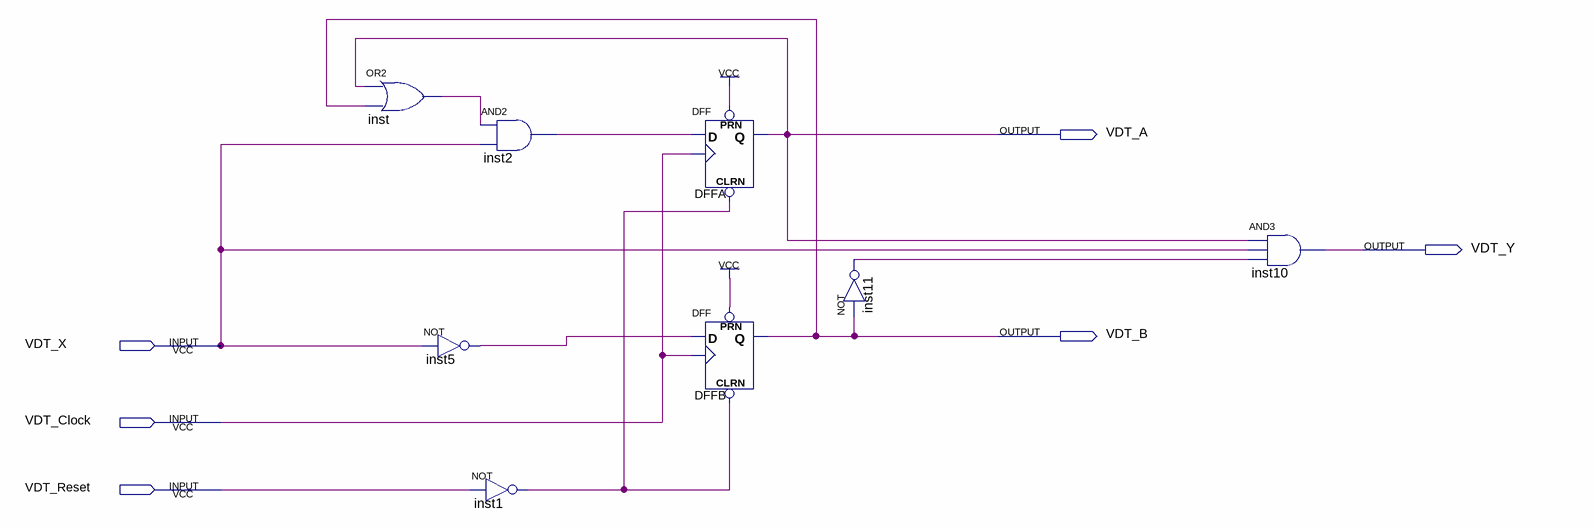
[diagram p0: schematic sheet]
// Quartus schematic assignment6.bdf as structural Verilog: 8 symbols, 6 pins
module assignment6 (
  input  VDT_X,
  input  VDT_Clock,
  input  VDT_Reset,
  output VDT_A,
  output VDT_Y,
  output VDT_B
);

  wire inst1_out, inst2_out, inst5_out, inst11_out, inst_out;

  or inst (inst_out, VDT_A, VDT_B);
  not inst5 (inst5_out, VDT_X);
  and inst2 (inst2_out, inst_out, VDT_X);
  not inst1 (inst1_out, VDT_Reset);
  DFF DFFA (.CLRN(inst1_out), .CLK(VDT_Clock), .D(inst2_out), .PRN(1'b1), .Q(VDT_A));
  DFF DFFB (.CLRN(inst1_out), .CLK(VDT_Clock), .D(inst5_out), .PRN(1'b1), .Q(VDT_B));
  not inst11 (inst11_out, VDT_B);
  and inst10 (VDT_Y, VDT_A, VDT_X, inst11_out);
endmodule
